# EasyEDA schematic SCH_Atari ST sidecart prototype shared bus_2023-09-15.json
TITLE: Atari ST sidecart board prototype; REV: 1.0; Date: 2023-07-13; Sheet: 1/1; Drawn By: logronoide; Company: GOODDATA LABS
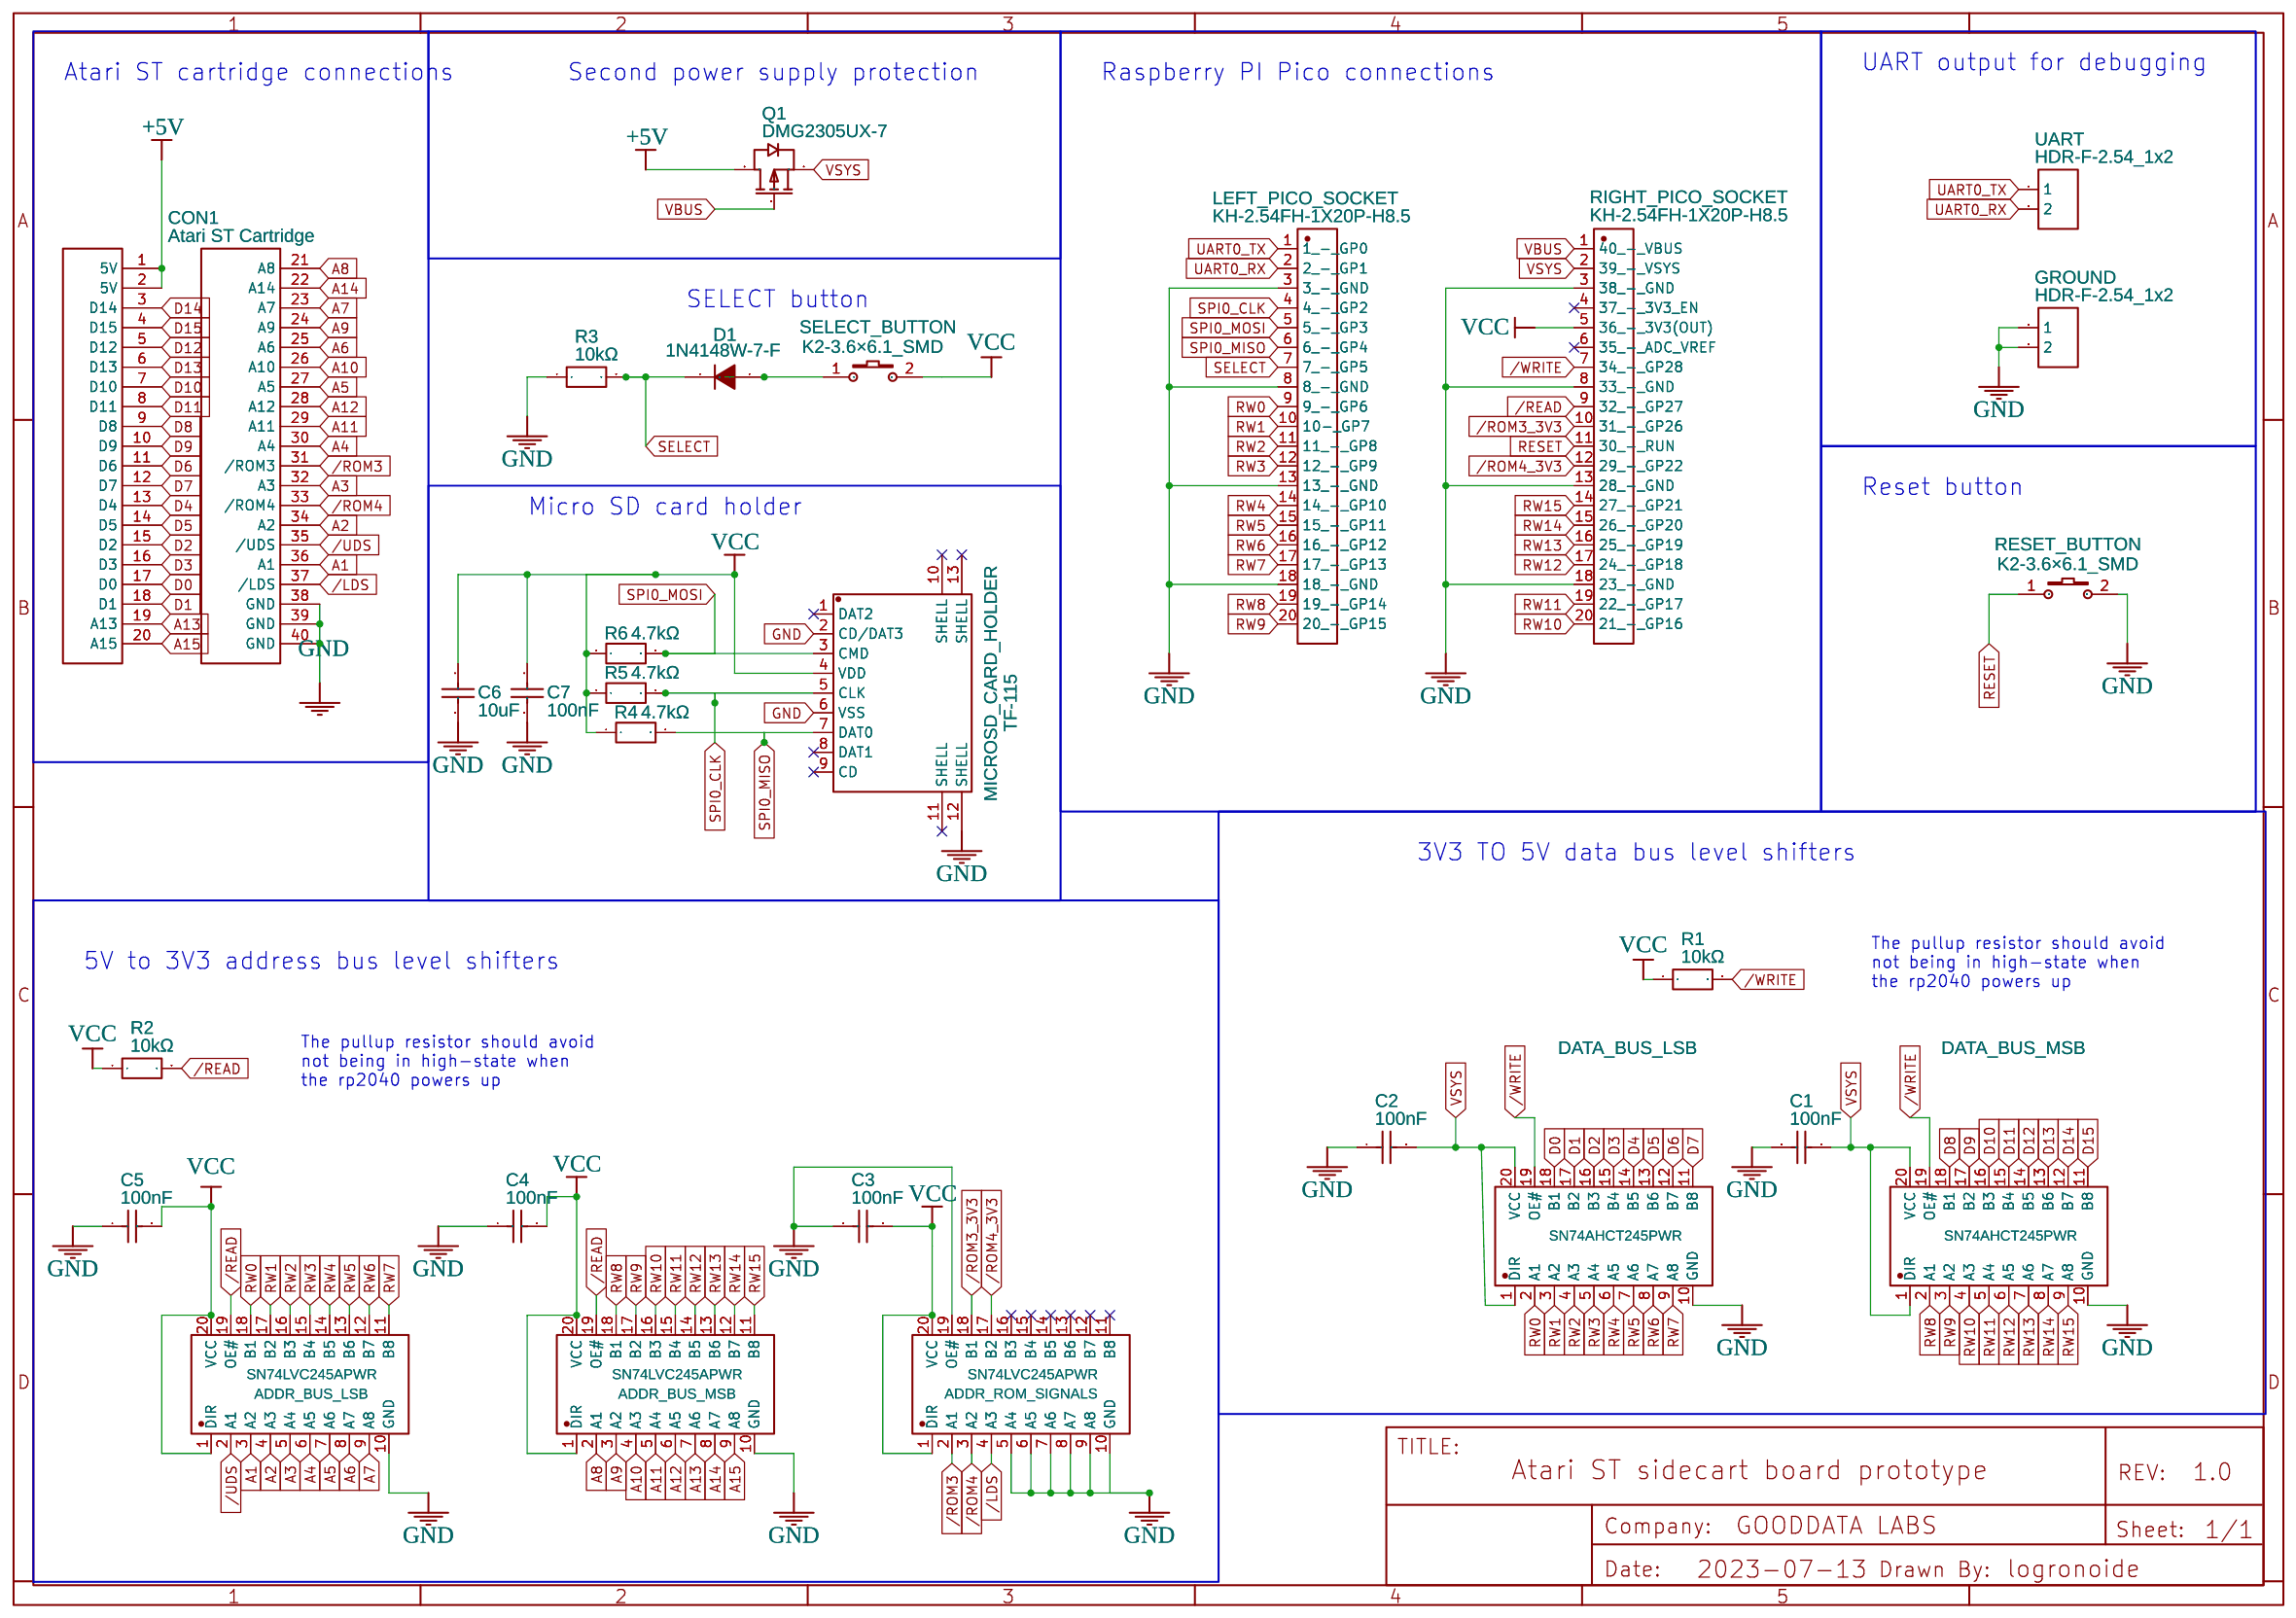
[diagram p0: schematic sheet]

## Parts
ADDR_BUS_LSB  SN74LVC245APWR  [TSSOP-20_L6.5-W4.4-P0.65-LS6.4-BL]
ADDR_BUS_MSB  SN74LVC245APWR  [TSSOP-20_L6.5-W4.4-P0.65-LS6.4-BL]
ADDR_ROM_SIGNALS  SN74LVC245APWR  [TSSOP-20_L6.5-W4.4-P0.65-LS6.4-BL]
C1  100nF  [C0603]
C2  100nF  [C0603]
C3  100nF  [C0603]
C4  100nF  [C0603]
C5  100nF  [C0603]
C6  10uF  [C0603]
C7  100nF  [C0603]
CON1  Atari ST Cartridge  [ATARI ST CARTRIDGE]
D1  1N4148W-7-F  [SOD-123_L2.7-W1.6-LS3.7-RD-1]
DATA_BUS_LSB  SN74AHCT245PWR  [TSSOP-20_L6.5-W4.4-P0.65-LS6.4-BL]
DATA_BUS_MSB  SN74AHCT245PWR  [TSSOP-20_L6.5-W4.4-P0.65-LS6.4-BL]
GROUND  HDR-F-2.54_1x2  [HDR-F-2.54_1X2]
LEFT_PICO_SOCKET  KH-2.54FH-1X20P-H8.5  [HDR-TH_20P-P2.54-V-F-2]
MICROSD_CARD_HOLDER  TF-115  [TF-SMD_TF-115]
Q1  DMG2305UX-7  [SOT-23-3_L2.9-W1.3-P1.90-LS2.4-BR]
R1  10kΩ  [R0603]
R2  10kΩ  [R0603]
R3  10kΩ  [R0603]
R4  4.7kΩ  [R0603]
R5  4.7kΩ  [R0603]
R6  4.7kΩ  [R0603]
RESET_BUTTON  K2-3.6×6.1_SMD  [KEY-SMD_2P-L6.2-W3.6-LS8.0]
RIGHT_PICO_SOCKET  KH-2.54FH-1X20P-H8.5  [HDR-TH_20P-P2.54-V-F-2]
SELECT_BUTTON  K2-3.6×6.1_SMD  [KEY-SMD_2P-L6.2-W3.6-LS8.0]
UART  HDR-F-2.54_1x2  [HDR-F-2.54_1X2]

## Library data of the parts
ADDR_BUS_LSB ADDR_BUS_MSB ADDR_ROM_SIGNALS = SN74LVC245ANG4: Supplier: LCSC; Supplier Part: C7848; Manufacturer: TI(德州仪器); Contributor: LCSC
C1-C5 C7 = C0603C104K5RACAUTO: Supplier: LCSC; Manufacturer: KEMET(基美); Supplier Part: C129621; JLCPCB Part Class: Extended Part; link: https://lcsc.com/eda_search?q=C129621&%26type=1&ref=editor
C6 = CC0603MRX5R7BB106: Supplier: LCSC; Manufacturer: YAGEO(国巨); Supplier Part: C109457; JLCPCB Part Class: Extended Part; link: https://lcsc.com/eda_search?q=C109457&%26type=1&ref=editor
CON1 = -: Contributor: nplanel
D1 = 1N4148W-7-F: Supplier: LCSC; Manufacturer: DIODES(美台); Supplier Part: C83528; JLCPCB Part Class: Extended Part; link: https://lcsc.com/eda_search?q=C83528&%26type=1&ref=editor
DATA_BUS_LSB DATA_BUS_MSB = SN74AHCT245N: Supplier: LCSC; Supplier Part: C10910; Manufacturer: TI(德州仪器); Contributor: LCSC; JLCPCB Part Class: Extended Part
GROUND UART = HDR-F-2.54_1x2: Supplier Part: C49661; Supplier: LCSC; Contributor: LCEDA_Lib
LEFT_PICO_SOCKET RIGHT_PICO_SOCKET = KH-2.54FH-1X20P-H8.5: Contributor: LCSC; Supplier: LCSC; Supplier Part: C2905423; Manufacturer: kinghelm(金航标); JLCPCB Part Class: Extended Part; link: https://lcsc.com/eda_search?q=C2905423&%26type=1&ref=editor
MICROSD_CARD_HOLDER = TF-115: Contributor: LCSC; Supplier: LCSC; Supplier Part: C266620; Manufacturer: XUNPU(讯普); JLCPCB Part Class: Extended Part; link: https://lcsc.com/eda_search?q=C266620&%26type=1&ref=editor
Q1 = DMG2305UX-7: Contributor: LCSC; Supplier: LCSC; Supplier Part: C150470; Manufacturer: DIODES(美台); JLCPCB Part Class: Extended Part; link: https://lcsc.com/eda_search?q=C150470&%26type=1&ref=editor
R1-R3 = RT0603DRE0710KL: Contributor: LCSC; Supplier: LCSC; Supplier Part: C706017; Manufacturer: YAGEO(国巨); JLCPCB Part Class: Extended Part; link: https://lcsc.com/eda_search?q=C706017&%26type=1&ref=editor
R4-R6 = CR0603F4K70P05Z: Contributor: LCSC; Supplier: LCSC; Supplier Part: C881083; Manufacturer: EVER OHMS(天二科技); JLCPCB Part Class: Extended Part; link: https://lcsc.com/eda_search?q=C881083&%26type=1&ref=editor
RESET_BUTTON SELECT_BUTTON = K2-3.6×6.1_SMD: Supplier Part: C118141; Supplier: LCSC; Manufacturer Part: K2-1107ST-A4SW-06; Contributor: LCEDA_Lib; 制造商: 韩国韩荣

## Nets
+5V: CON1.1(5V) CON1.2(5V) Q1.3(D)
GND: ADDR_BUS_LSB.10(GND) ADDR_BUS_MSB.10(GND) ADDR_ROM_SIGNALS.5(A4) ADDR_ROM_SIGNALS.6(A5) ADDR_ROM_SIGNALS.7(A6) ADDR_ROM_SIGNALS.8(A7) ADDR_ROM_SIGNALS.9(A8) ADDR_ROM_SIGNALS.10(GND) ADDR_ROM_SIGNALS.19(OE#) C1.1 C2.1 C3.1 C4.1 C5.1 C6.1 C7.1 CON1.38(GND) CON1.39(GND) CON1.40(GND) DATA_BUS_LSB.10(GND) DATA_BUS_MSB.10(GND) GROUND.1 GROUND.2 LEFT_PICO_SOCKET.3(3 - GND) LEFT_PICO_SOCKET.8(8 - GND) LEFT_PICO_SOCKET.13(13 - GND) LEFT_PICO_SOCKET.18(18 - GND) MICROSD_CARD_HOLDER.2(CD/DAT3) MICROSD_CARD_HOLDER.6(VSS) MICROSD_CARD_HOLDER.12(SHELL) R3.1 RESET_BUTTON.2 RIGHT_PICO_SOCKET.3(38 - GND) RIGHT_PICO_SOCKET.8(33 - GND) RIGHT_PICO_SOCKET.13(28 - GND) RIGHT_PICO_SOCKET.18(23 - GND)
VBUS: Q1.1(G) RIGHT_PICO_SOCKET.1(40 - VBUS)
VCC: ADDR_BUS_LSB.1(DIR) ADDR_BUS_LSB.20(VCC) ADDR_BUS_MSB.1(DIR) ADDR_BUS_MSB.20(VCC) ADDR_ROM_SIGNALS.1(DIR) ADDR_ROM_SIGNALS.20(VCC) C3.2 C4.2 C5.2 C6.2 C7.2 MICROSD_CARD_HOLDER.4(VDD) R1.1 R2.1 R4.1 R5.1 R6.1 RIGHT_PICO_SOCKET.5(36 - 3V3(OUT)) SELECT_BUTTON.2
/LDS: ADDR_ROM_SIGNALS.4(A3) CON1.37(/LDS)
/READ: ADDR_BUS_LSB.19(OE#) ADDR_BUS_MSB.19(OE#) R2.2 RIGHT_PICO_SOCKET.9(32 - GP27)
/ROM3: ADDR_ROM_SIGNALS.2(A1) CON1.31(/ROM3)
/ROM3_3V3: ADDR_ROM_SIGNALS.18(B1) RIGHT_PICO_SOCKET.10(31 - GP26)
/ROM4: ADDR_ROM_SIGNALS.3(A2) CON1.33(/ROM4)
/ROM4_3V3: ADDR_ROM_SIGNALS.17(B2) RIGHT_PICO_SOCKET.12(29 - GP22)
/UDS: ADDR_BUS_LSB.2(A1) CON1.35(/UDS)
/WRITE: DATA_BUS_LSB.19(OE#) DATA_BUS_MSB.19(OE#) R1.2 RIGHT_PICO_SOCKET.7(34 - GP28)
A1: ADDR_BUS_LSB.3(A2) CON1.36(A1)
A2: ADDR_BUS_LSB.4(A3) CON1.34(A2)
A3: ADDR_BUS_LSB.5(A4) CON1.32(A3)
A4: ADDR_BUS_LSB.6(A5) CON1.30(A4)
A5: ADDR_BUS_LSB.7(A6) CON1.27(A5)
A6: ADDR_BUS_LSB.8(A7) CON1.25(A6)
A7: ADDR_BUS_LSB.9(A8) CON1.23(A7)
A8: ADDR_BUS_MSB.2(A1) CON1.21(A8)
A9: ADDR_BUS_MSB.3(A2) CON1.24(A9)
A10: ADDR_BUS_MSB.4(A3) CON1.26(A10)
A11: ADDR_BUS_MSB.5(A4) CON1.29(A11)
A12: ADDR_BUS_MSB.6(A5) CON1.28(A12)
A13: ADDR_BUS_MSB.7(A6) CON1.19(A13)
A14: ADDR_BUS_MSB.8(A7) CON1.22(A14)
A15: ADDR_BUS_MSB.9(A8) CON1.20(A15)
D0: CON1.17(D0) DATA_BUS_LSB.18(B1)
D1: CON1.18(D1) DATA_BUS_LSB.17(B2)
D2: CON1.15(D2) DATA_BUS_LSB.16(B3)
D3: CON1.16(D3) DATA_BUS_LSB.15(B4)
D4: CON1.13(D4) DATA_BUS_LSB.14(B5)
D5: CON1.14(D5) DATA_BUS_LSB.13(B6)
D6: CON1.11(D6) DATA_BUS_LSB.12(B7)
D7: CON1.12(D7) DATA_BUS_LSB.11(B8)
D8: CON1.9(D8) DATA_BUS_MSB.18(B1)
D9: CON1.10(D9) DATA_BUS_MSB.17(B2)
D10: CON1.7(D10) DATA_BUS_MSB.16(B3)
D11: CON1.8(D11) DATA_BUS_MSB.15(B4)
D12: CON1.5(D12) DATA_BUS_MSB.14(B5)
D13: CON1.6(D13) DATA_BUS_MSB.13(B6)
D14: CON1.3(D14) DATA_BUS_MSB.12(B7)
D15: CON1.4(D15) DATA_BUS_MSB.11(B8)
RESET: RESET_BUTTON.1 RIGHT_PICO_SOCKET.11(30 - RUN)
RW0: ADDR_BUS_LSB.18(B1) DATA_BUS_LSB.2(A1) LEFT_PICO_SOCKET.9(9 - GP6)
RW1: ADDR_BUS_LSB.17(B2) DATA_BUS_LSB.3(A2) LEFT_PICO_SOCKET.10(10- GP7)
RW2: ADDR_BUS_LSB.16(B3) DATA_BUS_LSB.4(A3) LEFT_PICO_SOCKET.11(11 - GP8)
RW3: ADDR_BUS_LSB.15(B4) DATA_BUS_LSB.5(A4) LEFT_PICO_SOCKET.12(12 - GP9)
RW4: ADDR_BUS_LSB.14(B5) DATA_BUS_LSB.6(A5) LEFT_PICO_SOCKET.14(14 - GP10)
RW5: ADDR_BUS_LSB.13(B6) DATA_BUS_LSB.7(A6) LEFT_PICO_SOCKET.15(15 - GP11)
RW6: ADDR_BUS_LSB.12(B7) DATA_BUS_LSB.8(A7) LEFT_PICO_SOCKET.16(16 - GP12)
RW7: ADDR_BUS_LSB.11(B8) DATA_BUS_LSB.9(A8) LEFT_PICO_SOCKET.17(17 - GP13)
RW8: ADDR_BUS_MSB.18(B1) DATA_BUS_MSB.2(A1) LEFT_PICO_SOCKET.19(19 - GP14)
RW9: ADDR_BUS_MSB.17(B2) DATA_BUS_MSB.3(A2) LEFT_PICO_SOCKET.20(20 - GP15)
RW10: ADDR_BUS_MSB.16(B3) DATA_BUS_MSB.4(A3) RIGHT_PICO_SOCKET.20(21 - GP16)
RW11: ADDR_BUS_MSB.15(B4) DATA_BUS_MSB.5(A4) RIGHT_PICO_SOCKET.19(22 - GP17)
RW12: ADDR_BUS_MSB.14(B5) DATA_BUS_MSB.6(A5) RIGHT_PICO_SOCKET.17(24 - GP18)
RW13: ADDR_BUS_MSB.13(B6) DATA_BUS_MSB.7(A6) RIGHT_PICO_SOCKET.16(25 - GP19)
RW14: ADDR_BUS_MSB.12(B7) DATA_BUS_MSB.8(A7) RIGHT_PICO_SOCKET.15(26 - GP20)
RW15: ADDR_BUS_MSB.11(B8) DATA_BUS_MSB.9(A8) RIGHT_PICO_SOCKET.14(27 - GP21)
SELECT: D1.1(C) LEFT_PICO_SOCKET.7(7 - GP5) R3.2
SPI0_CLK: LEFT_PICO_SOCKET.4(4 - GP2) MICROSD_CARD_HOLDER.5(CLK) R5.2
SPI0_MISO: LEFT_PICO_SOCKET.6(6 - GP4) MICROSD_CARD_HOLDER.7(DAT0) R4.2
SPI0_MOSI: LEFT_PICO_SOCKET.5(5 - GP3) MICROSD_CARD_HOLDER.3(CMD) R6.2
UART0_RX: LEFT_PICO_SOCKET.2(2 - GP1) UART.2
UART0_TX: LEFT_PICO_SOCKET.1(1 - GP0) UART.1
VSYS: C1.2 C2.2 DATA_BUS_LSB.1(DIR) DATA_BUS_LSB.20(VCC) DATA_BUS_MSB.1(DIR) DATA_BUS_MSB.20(VCC) Q1.2(S) RIGHT_PICO_SOCKET.2(39 - VSYS)
Net-(D1-2): D1.2(A) SELECT_BUTTON.1

Not connected (* = marked no-connect by the designer): ADDR_ROM_SIGNALS 11(B8)* 12(B7)* 13(B6)* 14(B5)* 15(B4)* 16(B3)*; MICROSD_CARD_HOLDER 1(DAT2)* 8(DAT1)* 9(CD)* 10(SHELL)* 11(SHELL)* 13(SHELL)*; RIGHT_PICO_SOCKET 4(37 - 3V3_EN)* 6(35 - ADC_VREF)*

## Notes on the sheet
- Atari ST cartridge connections
- Second power supply protection
- Raspberry PI Pico connections
- UART output for debugging
- SELECT button
- Reset button
- Micro SD card holder
- 3V3 TO 5V data bus level shifters
- 5V to 3V3 address bus level shifters
- The pullup resistor should avoid
  not being in high-state when
  the rp2040 powers up
- The pullup resistor should avoid
  not being in high-state when
  the rp2040 powers up
